# Altium schematic sheet power.SchDoc: Power Regulation
size A4; SheetNumber: 2; SheetTotal: 8
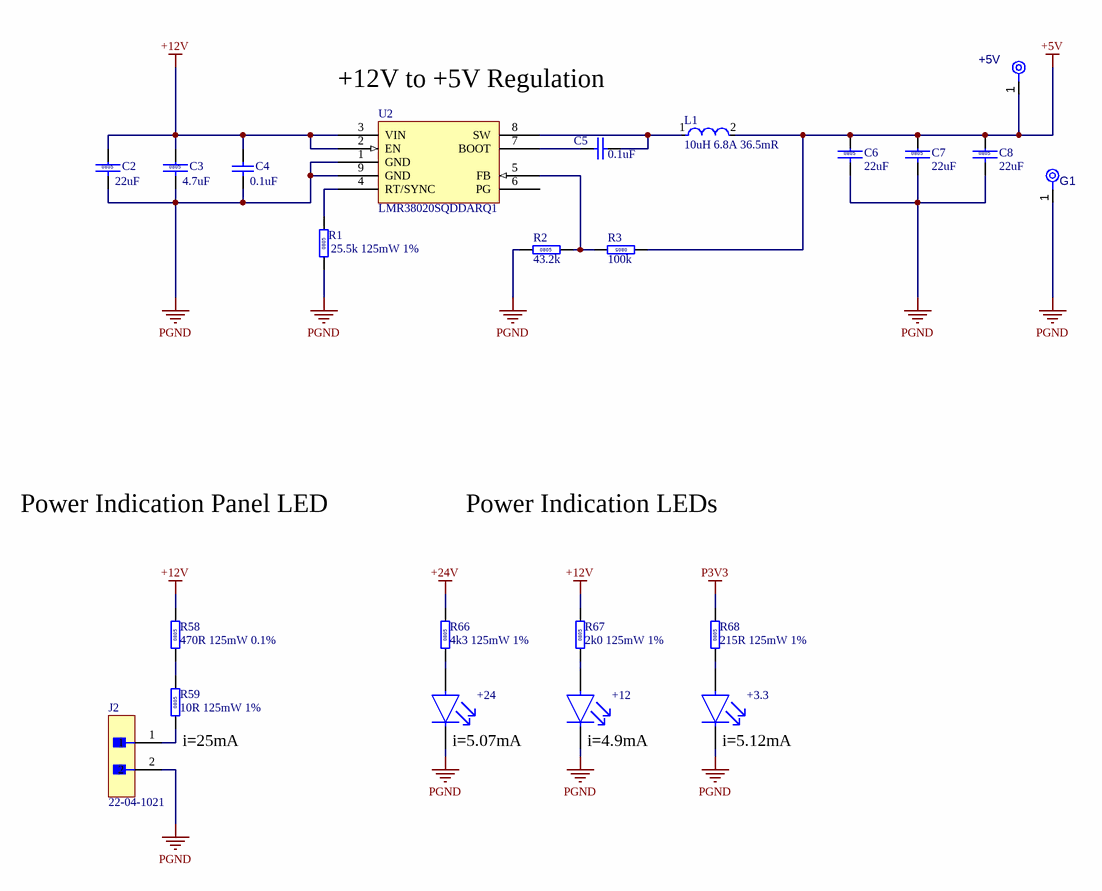
[diagram p0: power.SchDoc]

## Parts
+3.3  KPTR-3216SGC  [KPTR-3216SGC-Footprint-1 T-variant]  (value not drawn)
+5V  1.7mm Testpoint  [TestPoint_1-7thp]  (value not drawn)  (no BOM)
+12  KPTR-3216SGC  [KPTR-3216SGC-Footprint-1 T-variant]  (value not drawn)
+24  KPTR-3216SGC  [KPTR-3216SGC-Footprint-1 T-variant]  (value not drawn)
C2  22uF  [CAPC2012X14N]
C3  4.7uF  [CAPC2012X14N]
C4  0.1uF  [CAPC2012X14N]
C5  0.1uF  [CAPC2012X14N]
C6  22uF  [CAPC2012X14N]
C7  22uF  [CAPC2012X14N]
C8  22uF  [CAPC2012X14N]
G1  1.7mm Testpoint  [TestPoint_1-7thp]  (value not drawn)  (no BOM)
J2  22-04-1021  [0022041021_MFG]
L1  10uH 6.8A 36.5mR  [FP-IHLP-4040DZ-FP_3_124x3-MFG]
R1  25.5k 125mW 1%  [RESC2013X60X35NL10T20]
R2  43.2k  [RESC2013X60X35NL10T20]
R3  100k  [RESC2013X60X35NL10T20]
R58  470R 125mW 0.1%  [RESC2013X60X35NL10T20]
R59  10R 125mW 1%  [RESC2013X60X35NL10T20]
R66  4k3 125mW 1%  [RESC2013X60X35NL10T20]
R67  2k0 125mW 1%  [RESC2013X60X35NL10T20]
R68  215R 125mW 1%  [RESC2013X60X35NL10T20]
U2  LMR38020SQDDARQ1  [SOIC127P600X170_HS-9N]

## Nets
+5V: +5V.1(TP) C6.1 C7.1 C8.1 L1.2 R3.1
+12V: C2.1 C3.1 C4.2 R58.2 R67.2 U2.2(EN) U2.3(VIN)
+24V: R66.2
P3V3: R68.2
PGND: +3.3.2(C) +12.2(C) +24.2(C) C2.2 C3.2 C4.1 C6.2 C7.2 C8.2 G1.1(TP) J2.2 R1.1 R2.1 U2.1(GND) U2.9(GND)
Net+3.3_1: +3.3.1(A) R68.1
Net+12_1: +12.1(A) R67.1
Net+24_1: +24.1(A) R66.1
NetC5_1: C5.1 L1.1 U2.8(SW)
NetC5_2: C5.2 U2.7(BOOT)
NetJ2_1: J2.1 R59.1
NetR1_2: R1.2 U2.4(RT/SYNC)
NetR2_2: R2.2 R3.2 U2.5(FB)
NetR58_1: R58.1 R59.2

Not connected (* = marked no-connect by the designer): U2 6(PG)

## Notes on the sheet
- +12V to +5V Regulation
- Power Indication Panel LED
- Power Indication LEDs
- (near R59) i=25mA
- (near +24) i=5.07mA
- (near +12) i=4.9mA
- (near +3.3) i=5.12mA

## Library data of the parts
+3.3 +12 +24 = CMP-40-060-00012-8: Single Color LED, Super Bright Green, Water Clear, 1.6mm; Manufacturer: Kingbright; Reverse Voltage-Max: 5V; Overall Height: 1.05mm; Forward Current: 25mA; Forward Voltage: 2.5V; Channels: 1; Shape: Rectangular; ComponentLinkDescription: Datasheet; Luminous Intensity-Nom: 15mcd; Viewing Angle: 120°; Luminous Intensity-Min: 120cd; Packaging: Tape and Reel; Maximum Operating Temperature: 85°C; Color: Green; Min Operating Temperature: -40°C; Mounting Technology: Surface Mount; Reach SVHC Compliant: Yes; Color@wavelength: Green; Lens Style: WATER CLEAR; Terminal Pitch: 3.6mm; ForwardVoltage: 2.5V; ManufacturerPartNumber: KPTR-3216SGC; ComponentLinkURL: https://datasheet.ciiva.com/pdfs/VipMasterIC/IC/KNGB/KNGBS03251/KNGBS03251-1.pdf?src-supplier=IHS+Markit; Minimum Operating Temperature: -40°C; Max Operating Temperature: 85°C; RoHS Compliant: Yes; MountingType: SMD; Size: 1.6mm; Pins: 2; Optoelectronic Device Type: SINGLE COLOR LED; Colour: Super Bright Green; Package: 1206
+5V G1 = CMP-40-090-00002-6: NON BOM, Tespoint, Plated, Electrically Connected
C2 C6-C8 = CMP-40-005-00017-4: Cap, SMD, 22uF, 25V, 15%, 0805, X5R; Manufacturer: Murata; ManufacturerPartNumber: GRM21BR61E226ME44L; ComponentLinkDescription: Datasheet; CapacitorType: Ceramic; Value: 22µF; MountingType: SMD; DielectricType: X5R; ComponentLinkURL: https://www.murata.com/en-us/products/productdetail?partno=GRM21BR61E226ME44%23; Package: 0805; VoltageRating: 25V; Tolerance: 15%
C3 = CMP-40-005-00016-4: Cap, SMD, 4.7uF, 50V, 10%, 0805, X5R; Manufacturer: Murata; ManufacturerPartNumber: GRM21BR61H475KE51L; ComponentLinkDescription: Datasheet; Value: 4.7µF; CapacitorType: Ceramic; DielectricType: X5R; Package: 0805; VoltageRating: 50V; MountingType: SMD; Tolerance: 10%; ComponentLinkURL: https://www.murata.com/en-us/products/productdetail?partno=GRM21BR61H475KE51%23
C4 C5 = CMP-40-005-00117-1: Cap, SMD, 0.1uF, 50V, 10%, 0805, X7R; Manufacturer: Samsung; ManufacturerPartNumber: CL21B104KBCWPNC; CapacitorType: Ceramic; Value: 100nF; ComponentLinkDescription: Datasheet; Package: 0805; MountingType: SMD; VoltageRating: 50V; Tolerance: 10%; ComponentLinkURL: https://octopart.com/part/samsung-electro-mechanics/CL21B104KBCWPNC; DielectricType: Ceramic
J2 = CMP-40-050-00147-1: Pin Header, Wire-to-Board, 2.5 mm, 1 Rows, 2 Contacts, Through Hole Straight, KK 5045 Series; Manufacturer: Molex; Current Rating: 3A; ComponentLinkDescription: Datasheet; Jack/Receptacle: Male; Number of Ways: 2; MountingType: Through hole; ManufacturerPartNumber: 22-04-1021; ConnectorType: Header; Number of Rows: 1; ComponentLinkURL: https://octopart.com/part/molex/22-04-1021
L1 = CMP-40-020-00018-1: Ind, SMD, 10uH, 46.5mR, las = 12.0A; Manufacturer: Vishay; ManufacturerPartNumber: IHLP4040DZER100MA1; Value: 10µH; Saturation Current: 12A; Tolerance: 20%; ComponentLinkDescription: Datasheet; MountingType: 2; Max Current Rating: 6.8A; ComponentLinkURL: https://octopart.com/part/vishay/IHLP4040DZER100MA1; Package: Nonstamdard
R1 = CMP-40-025-00256-1: Res, SMD, 25.5k, 125mW, 1%, ±100ppm, 0805; ManufacturerPartNumber: ERJ-6ENF2552V; Manufacturer: Panasonic; ComponentLinkDescription: Datasheet; Package Height: 0.6mm; Voltage Rating: 150V; Temperature Coefficient (ppm/cel): ±100ppm; RoHS3Compliant: Yes; Max Operating Temperature: 155°C; Mount: SMD; Min Operating Temperature: -55°C; Composition: Thick Film; Case/Package: 0805; Number of Pins: 2; Contact Plating: Tin; Power Rating: 125mW; Reach SVHC Compliant: Unaffected; Resistor Type: Fixed; ComponentLinkURL: https://octopart.com/part/panasonic/ERJ-6ENF2552V; Resistance: 25.5k; Tolerance: 1%
R2 = CMP-40-025-00258-1: Res, SMD, 43.2k 125mW, 0.1%, ±25ppm, 0805; ManufacturerPartNumber: ERA6AEB4322V; Manufacturer: Panasonic; Voltage Rating: 100V; ComponentLinkDescription: Datasheet; Package Height: 0.6mm; Composition: Metal Film, Thin Film; ComponentLinkURL: https://octopart.com/part/panasonic/ERA6AEB4322V; Temperature Coefficient (ppm/cel): ±25ppm; Tolerance: 0.1%; Case/Package: 0805; Max Operating Temperature: 155°C; Power Rating: 125mW; RoHS3Compliant: Yes; Reach SVHC Compliant: Unaffected; Min Operating Temperature: -55°C; Mount: SMD; Contact Plating: Tin; Resistor Type: Fixed; Number of Pins: 2; Resistance: 43.2k
R3 = CMP-40-025-00231-1: Res, SMD, 100k, 125mW, 0.1%, ±25ppm, 0805; Manufacturer: Panasonic; ManufacturerPartNumber: ERA-6AEB104V; Voltage Rating: 100V; ComponentLinkDescription: Datasheet; Package Height: 0.6; Power Rating: 125mW; Resistor Type: Fixed; RoHS3Certificate: https://download.siliconexpert.com/pdfs2/2024/6/2/9/59/48/925943/pns_/manual/erj6enf2700v_rohs.pdf; Mount: SMD; Case/Package: 0805; Composition: Thin Film; Temperature Coefficient (ppm/cel): ±25ppm; Min Operating Temperature: -55°C; ComponentLinkURL: https://octopart.com/era-6aeb104v-panasonic-1193246; Tolerance: 0.1%; Number of Pins: 2; Reach SVHC Compliant: Unaffected; RoHS3Compliant: Yes (with excemption); Contact Plating: Tin; Max Operating Temperature: 155°C; Resistance: 100k
R58 = CMP-40-025-00266-1: Res, SMD, 470R, 125mW, 0.1%, ±25ppm, 0805; ManufacturerPartNumber: ERA6AEB471V; Manufacturer: Panasonic; Resistance: 470; Package Height: 0.6mm; ComponentLinkDescription: Datasheet; Voltage Rating: 100V; Number of Pins: 2; ComponentLinkURL: https://octopart.com/part/panasonic/ERA6AEB471V; Case/Package: 0805; RoHS3Compliant: Yes; Tolerance: 0.1%; Resistor Type: Fixed; Reach SVHC Compliant: Unaffected; Composition: Thin Film; Temperature Coefficient (ppm/cel): ±25ppm; Max Operating Temperature: 155°C; Power Rating: 125mW; Mount: SMD; Min Operating Temperature: -55°C; Contact Plating: Tin
R59 = CMP-40-025-00265-1: Res, SMD, 10R, 125mW, 1%, ±100ppm, 0805; Manufacturer: Panasonic; ManufacturerPartNumber: ERJ-6ENF10R0V; Resistance: 10; ComponentLinkDescription: Datasheet; Voltage Rating: 150V; Package Height: 0.6mm; Min Operating Temperature: -55°C; Resistor Type: Fixed; Reach SVHC Compliant: Unaffected; Contact Plating: Tin; Temperature Coefficient (ppm/cel): ±100ppm; Mount: SMD; Power Rating: 125mW; Max Operating Temperature: 155°C; Composition: Thick Film; ComponentLinkURL: https://octopart.com/part/panasonic/ERJ-6ENF10R0V; Case/Package: 0805; Number of Pins: 2; RoHS3Compliant: Yes; Tolerance: 1%
R66 = CMP-40-025-00245-1: Res, SMD, 4k3, 125mW, 1%, ±100ppm, 0805; ManufacturerPartNumber: ERJ-6ENF4301V; Manufacturer: Panasonic; Package Height: 0.6mm; ComponentLinkDescription: Datasheet; Resistance: 4.3k; Voltage Rating: 150V; Temperature Coefficient (ppm/cel): ±100ppm; Reach SVHC Compliant: Unaffected; Tolerance: 1%; ComponentLinkURL: https://octopart.com/part/panasonic/ERJ-6ENF4301V; Power Rating: 125mW; Resistor Type: Fixed; Contact Plating: Tin; Max Operating Temperature: 155°C; Number of Pins: 2; Min Operating Temperature: -55°C; Mount: SMD; Case/Package: 0805; Composition: Thick Film; RoHS3Compliant: Yes (with excemption)
R67 = CMP-40-025-00259-1: Res, SMD, 2k0, 125mW, 1%, ±100ppm, 0805; ManufacturerPartNumber: ERJ-6ENF2001V; Manufacturer: Panasonic; Voltage Rating: 150V; Package Height: 0.6mm; ComponentLinkDescription: Datasheet; Resistance: 2k; Power Rating: 125mW; Mount: SMD; RoHS3Compliant: Yes; Case/Package: 0805; Max Operating Temperature: 155°C; Reach SVHC Compliant: Unaffected; Composition: Thick Film; Contact Plating: Tin; Tolerance: 1%; Temperature Coefficient (ppm/cel): ±100ppm; Number of Pins: 2; Min Operating Temperature: -55°C; Resistor Type: Fixed; ComponentLinkURL: https://octopart.com/part/panasonic/ERJ-6ENF2001V
R68 = CMP-40-025-00246-1: Res, SMD, 215R, 125mW, 1%, ±100ppm, 0805; ManufacturerPartNumber: ERJ-6ENF2150V; Manufacturer: Panasonic; Voltage Rating: 150V; ComponentLinkDescription: Datasheet; Package Height: 0.6; Resistance: 215; Temperature Coefficient (ppm/cel): ±100ppm; Tolerance: 1%; ComponentLinkURL: https://octopart.com/part/panasonic/ERJ-6ENF2150V; RoHS3Compliant: Yes (with excemption); Power Rating: 125mW; Reach SVHC Compliant: Unaffected; Number of Pins: 2; Composition: Thick Film; Resistor Type: Fixed; Max Operating Temperature: 155°C; Contact Plating: Tin; Mount: SMD; Min Operating Temperature: -55°C; Case/Package: 0805
U2 = CMP-40-080-00204-2: Switching Regulator, Current-mode, 2A, 2200kHz Switching Freq-Max, PDSO8; Manufacturer: Texas Instruments; ComponentLinkDescription: Datasheet; ComponentLinkURL: https://octopart.com/part/texas-instruments/LMR38020SQDDARQ1; Package: DDA Package, 8-Pin HSOIC; MountingType: SMD; Type: Switcher; ManufacturerPartNumber: LMR38020SQDDARQ1